# EAGLE design BesheRawanSafi (EAGLE 7.7.0)
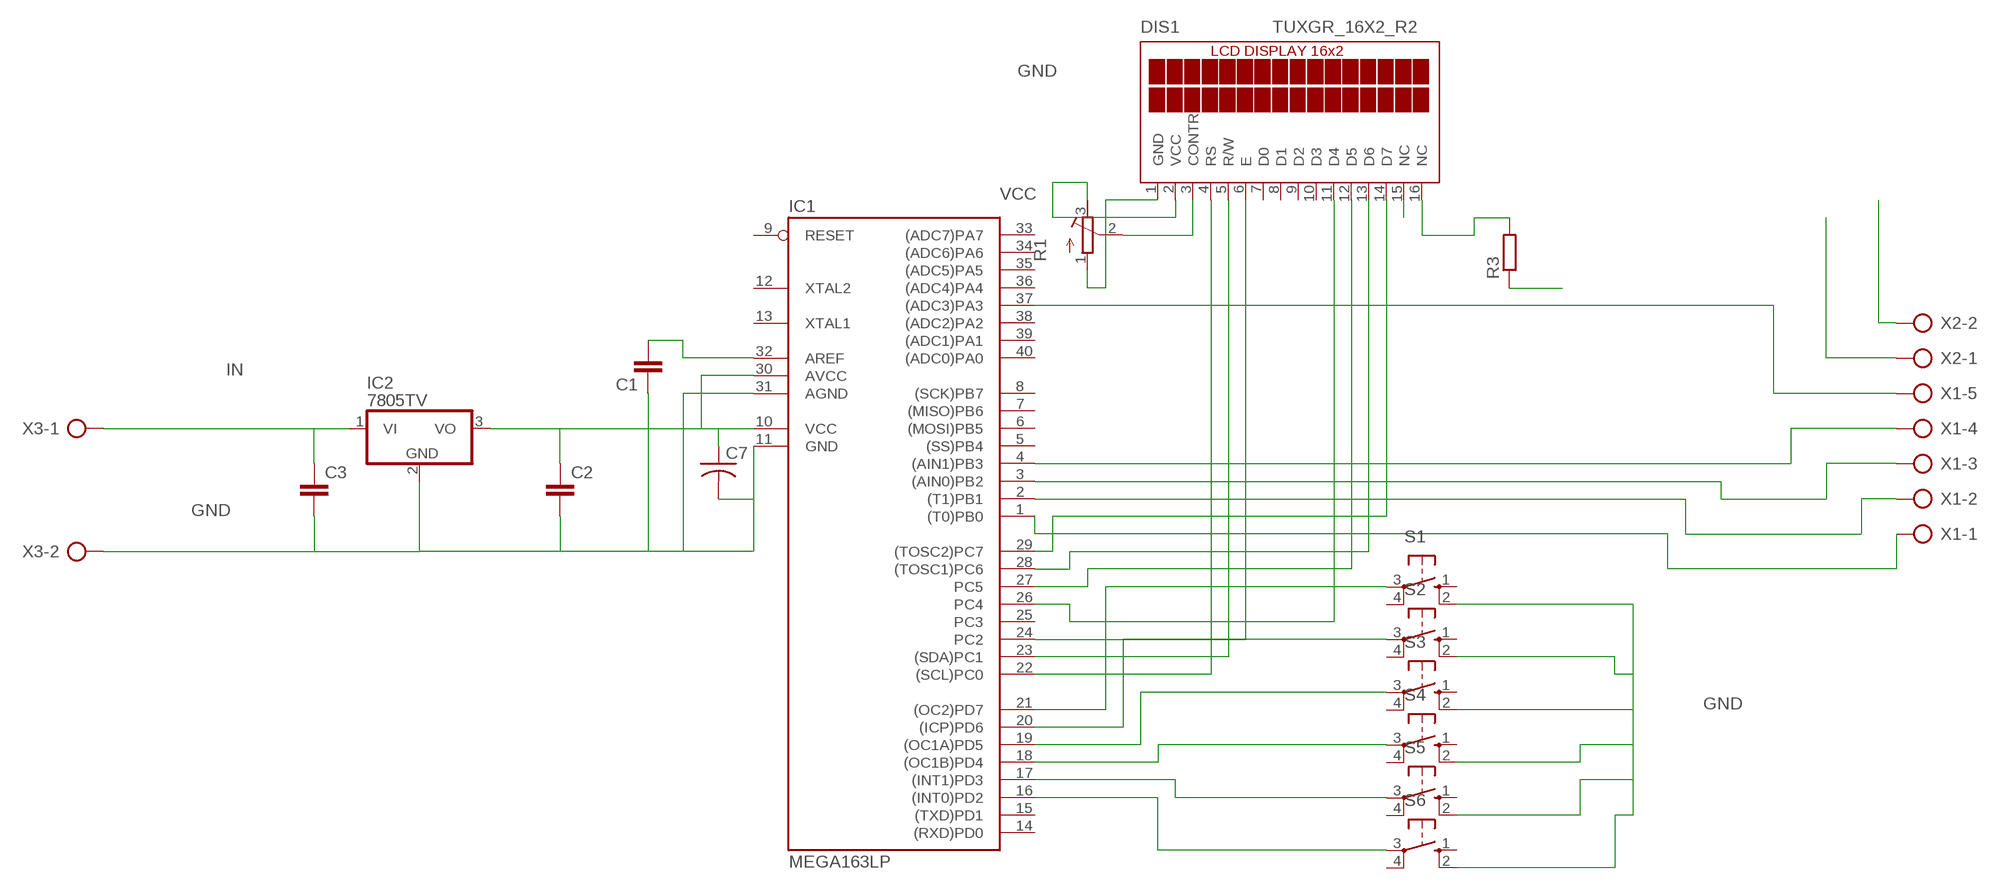
[diagram p0: schematic, sheet 1]

## Parts
C1  C5/3  [C5B3]
C2  C5/3  [C5B3]
C3  C5/3  [C5B3]
C7  C-US050-035X075  [C050-035X075]
DIS1  TUXGR_16X2_R2  [TUXGR_16X2_R2]
IC1  MEGA163LP  [DIL40]
IC2  7805TV  [TO220V]
R1  R-TRIMM64X  [RTRIM64X]
R3  R-EU_0207/7  [0207/7]
S1  10-XX  [B3F-10XX]
S2  10-XX  [B3F-10XX]
S3  10-XX  [B3F-10XX]
S4  10-XX  [B3F-10XX]
S5  10-XX  [B3F-10XX]
S6  10-XX  [B3F-10XX]
X1  AK500/5-H  [AK500/5-H]
X2  AK500/2-H  [AK500/2-H]
X3  AK300/2  [AK300/2]

## Nets
ASDASD: DIS1.16(NC) R3.2
GND: C1.1 C2.2 C3.2 C7.2 DIS1.1(GND) IC1.11(GND) IC1.31(AGND) IC2.2(GND) R1.1(E) R3.1 S1.2(S1) S2.2(S1) S3.2(S1) S4.2(S1) S5.2(S1) S6.2(S1) X2.1 X3.2
IN: C3.1 IC2.1(VI) X3.1
N$1: IC1.1((T0)PB0) X1.1
N$2: IC1.2((T1)PB1) X1.2
N$3: C1.2 IC1.32(AREF)
N$4: IC1.3((AIN0)PB2) X1.3
N$5: IC1.4((AIN1)PB3) X1.4
N$6: DIS1.13(D6) IC1.28((TOSC1)PC6)
N$7: DIS1.14(D7) IC1.29((TOSC2)PC7)
N$8: DIS1.12(D5) IC1.27(PC5)
N$9: DIS1.11(D4) IC1.26(PC4)
N$10: IC1.37((ADC3)PA3) X1.5
N$11: DIS1.4(RS) IC1.22((SCL)PC0)
N$12: DIS1.5(R/W) IC1.23((SDA)PC1)
N$13: DIS1.6(E) IC1.24(PC2)
N$15: DIS1.3(CONTR) R1.2(S)
N$25: IC1.21((OC2)PD7) S1.3(P)
N$26: IC1.20((ICP)PD6) S2.3(P)
N$27: IC1.19((OC1A)PD5) S3.3(P)
N$28: IC1.18((OC1B)PD4) S4.3(P)
N$29: IC1.17((INT1)PD3) S5.3(P)
N$30: IC1.16((INT0)PD2) S6.3(P)
VCC: C2.1 C7.1 DIS1.2(VCC) DIS1.15(NC) IC1.10(VCC) IC1.30(AVCC) IC2.3(VO) R1.3(A) X2.2
Unconnected: DIS1.7(D0) DIS1.8(D1) DIS1.9(D2) DIS1.10(D3) IC1.5((SS)PB4) IC1.6((MOSI)PB5) IC1.7((MISO)PB6) IC1.8((SCK)PB7) IC1.9(RESET) IC1.12(XTAL2) IC1.13(XTAL1) IC1.14((RXD)PD0) IC1.15((TXD)PD1) IC1.25(PC3) IC1.33((ADC7)PA7) IC1.34((ADC6)PA6) IC1.35((ADC5)PA5) IC1.36((ADC4)PA4) IC1.38((ADC2)PA2) IC1.39((ADC1)PA1) IC1.40((ADC0)PA0) S1.1(S) S1.4(P1) S2.1(S) S2.4(P1) S3.1(S) S3.4(P1) S4.1(S) S4.4(P1) S5.1(S) S5.4(P1) S6.1(S) S6.4(P1)

## Library data of the parts
C1-C3 = capacitor-wima:C: CAPACITOR naming: grid - package width
C7 = resistor:C-US: CAPACITOR, American symbol
DIS1 = display-lcd:TUXGR_16X2_R2: Tuxgraphics LCD display 16x2 characters reflective, without background light Source: tuxgr_12x2_r2.pdf; OC_FARNELL: unknown; OC_NEWARK: unknown
IC1 = atmel:MEGA163*P: MICROCONTROLLER 16 Kbytes FLASH 1 Kbytes EEPROM 1 Kbytes SRAM UART 8-channel 10 bit ADC hardware multiplier Source: avr.lbr; OC_FARNELL: unknown; OC_NEWARK: unknown
IC2 = linear:78*: Positive VOLTAGE REGULATOR Source: http://cache.national.com/ds/LM/LM78L05.pdf http://www.fairchildsemi.com/ds/LM/LM7805.pdf
R1 = resistor:R-TRIMM: Trimm resistor
R3 = rcl:R-EU_: RESISTOR, European symbol
S1-S6 = switch-omron:10-XX: OMRON SWITCH; MPN: B3F-1000; OC_FARNELL: 176432; OC_NEWARK: 36M3542
X1 = con-ptr500:AK500/5-H: CONNECTOR Aug. 2004 / PTR Meßtechnik: Die Bezeichnung der Serie AK505 wurde geändert. Es handelt sich hierbei um AK500 in horizontaler Ausführung.; OC_FARNELL: unknown; OC_NEWARK: unknown
X2 = con-ptr500:AK500/2-H: CONNECTOR Aug. 2004 / PTR Meßtechnik: Die Bezeichnung der Serie AK505 wurde geändert. Es handelt sich hierbei um AK500 in horizontaler Ausführung.; OC_FARNELL: unknown; OC_NEWARK: unknown
X3 = con-ptr500:AK300/2: CONNECTOR; OC_FARNELL: unknown; OC_NEWARK: unknown

## Board
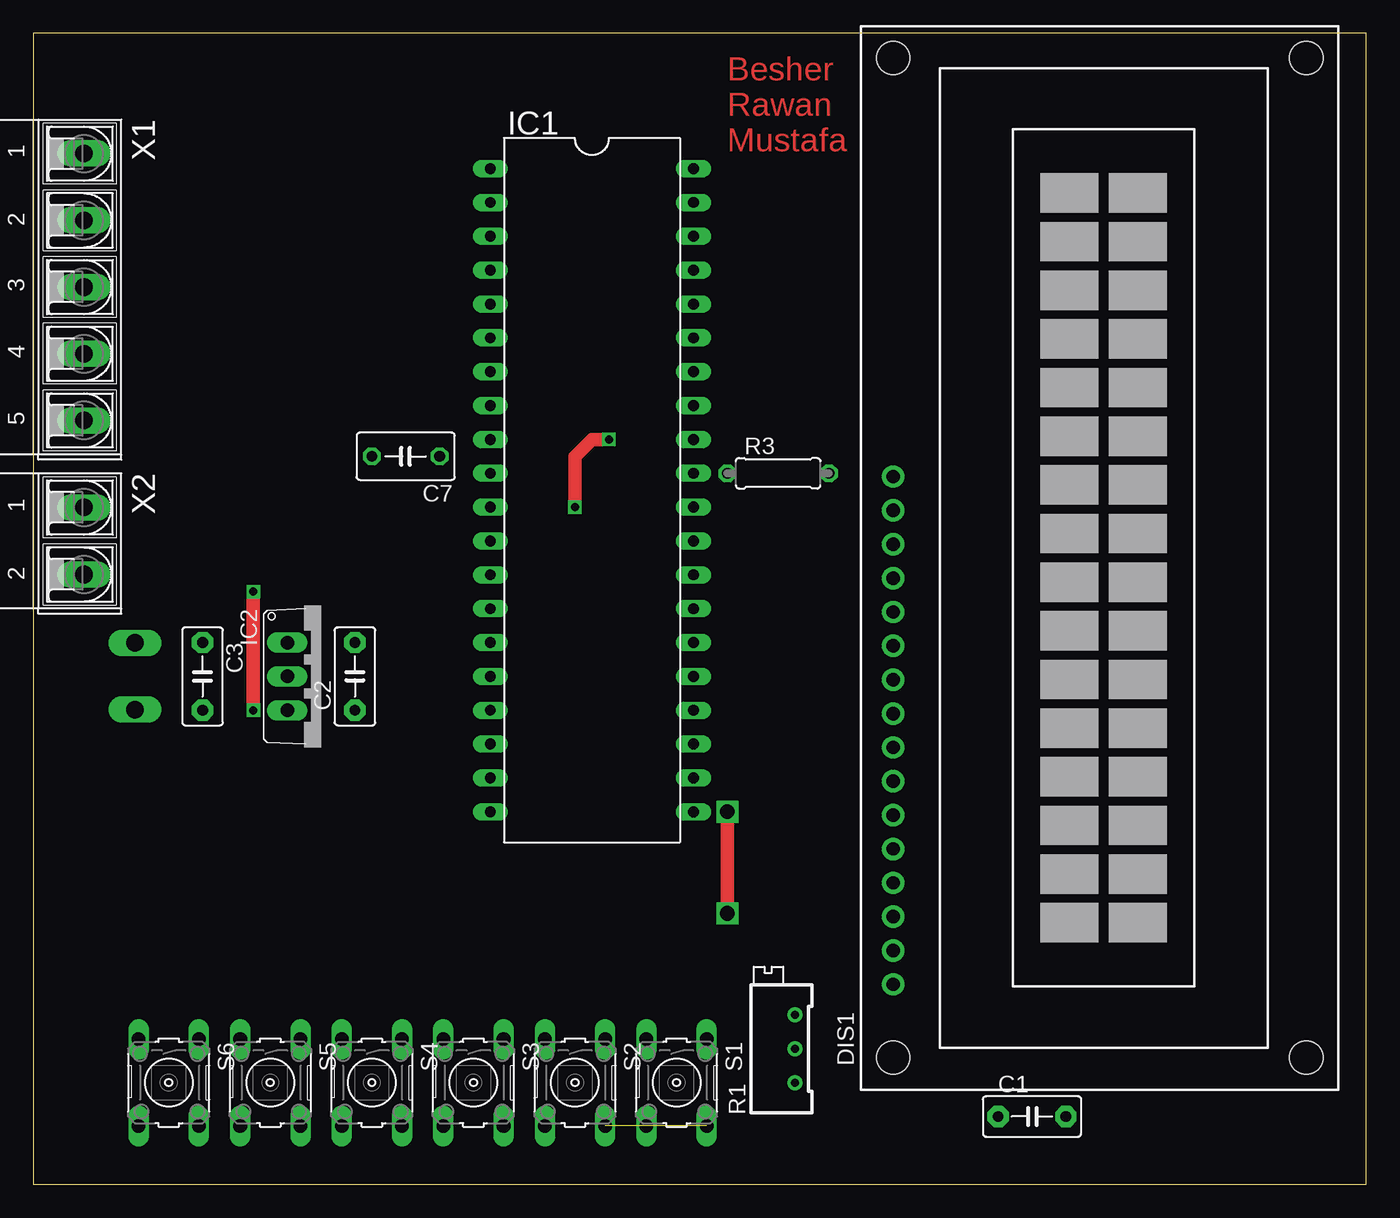
[diagram p1: board, top side]
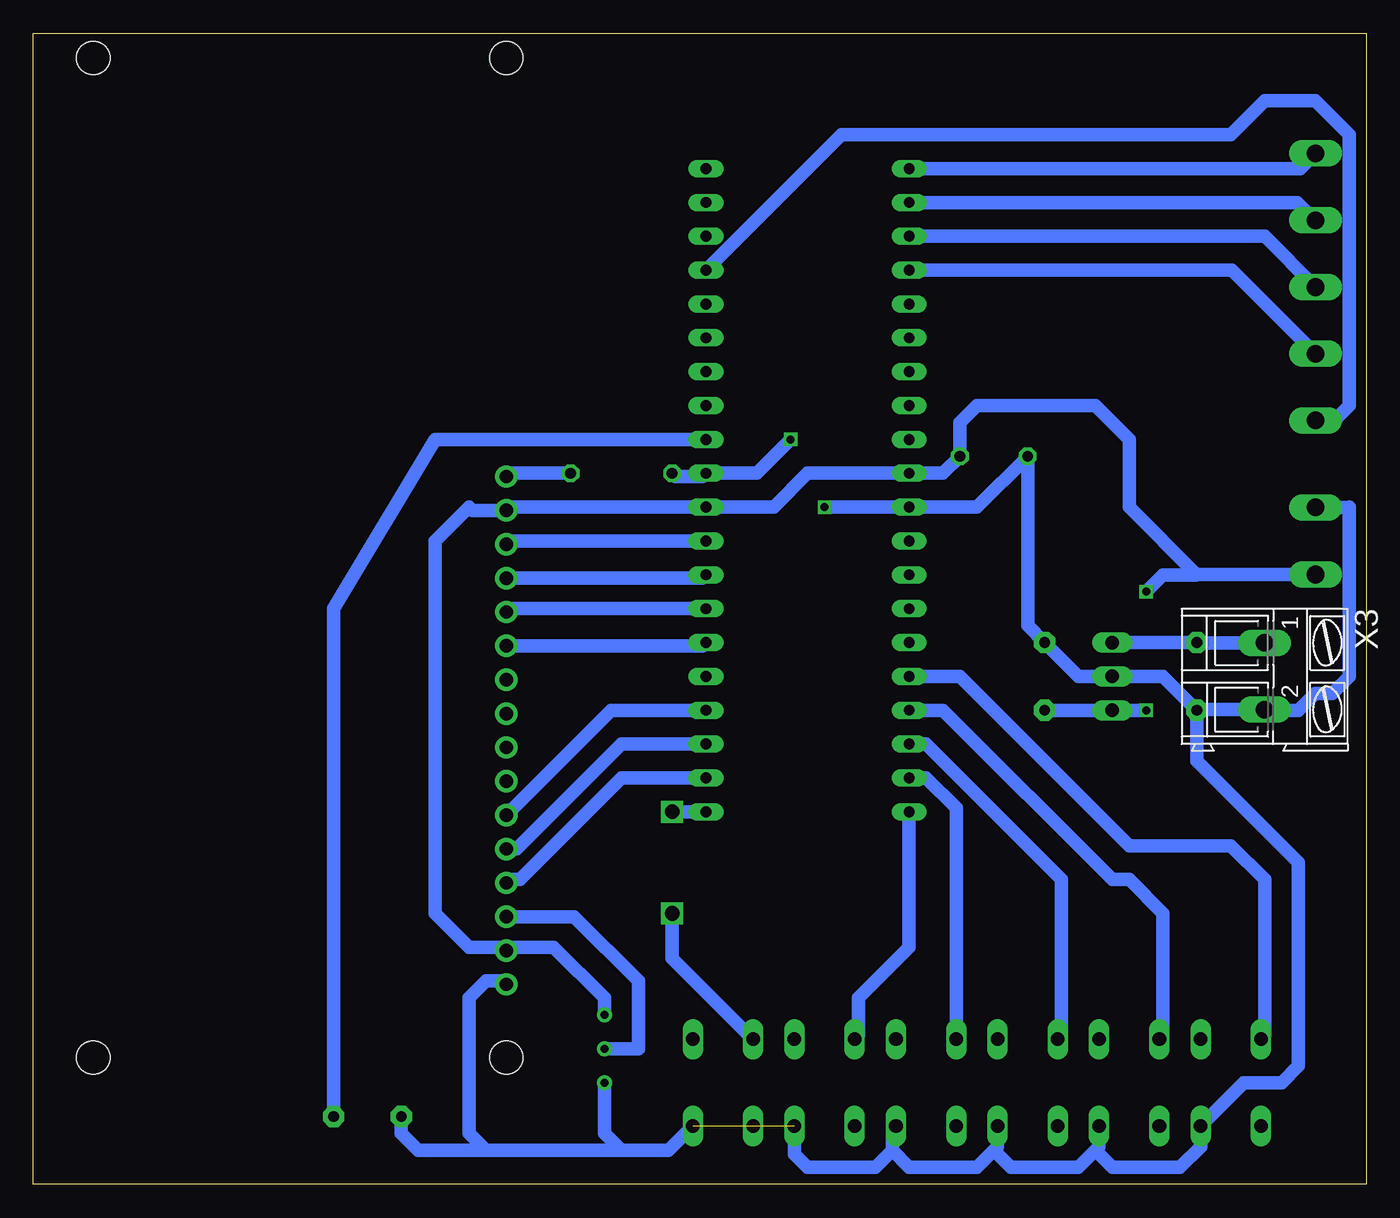
[diagram p2: board, bottom side, seen from below]

Size 100 x 86.35 mm. Coordinates in mm from the lower left corner, seen from the top.
Outline: 0,0 100,0 100,86.35 0,86.35 0,0
Copper layers (1*16): Top 0.035mm / dielectric 1.5mm / Bottom 0.035mm
Design rules "default": minimum track width 10mil, minimum drill 24mil, track to track 8mil, track to pad 8mil, pad to pad 8mil, via to via 8mil, smd to smd 8mil, copper to edge 40mil, drill to drill 8mil, minimum pad ring 10mil, minimum via ring 8mil, stop-mask expansion 4mil, vias tented up to drill 0mil, thermal gap 10mil

### Footprints (pad centres in the part's own frame; a part is rotated, then mirrored left to right if it is on the bottom)
C5B3 = drill 0.813 pad 1.6 octagon: 1 -2.54,0; 2 2.54,0
C050-035X075 = drill 0.813 octagon: 1 -2.54,0; 2 2.54,0
TUXGR_16X2_R2 = drill 1 pad 1.676: 1 -32,15.5; 2 -29.46,15.5; 3 -26.92,15.5; 4 -24.38,15.5; 5 -21.84,15.5; 6 -19.3,15.5; 7 -16.76,15.5; 8 -14.22,15.5; 9 -11.68,15.5; 10 -9.14,15.5; 11 -6.6,15.5; 12 -4.06,15.5; 13 -1.52,15.5; 14 1.02,15.5; 15 3.56,15.5; 16 6.1,15.5 | hole 2.5: -37.5,-15.5; 37.5,-15.5; -37.5,15.5; 37.5,15.5
DIL40 = drill 0.813 long: 1 -24.13,-7.62; 2 -21.59,-7.62; 3 -19.05,-7.62; 4 -16.51,-7.62; 5 -13.97,-7.62; 6 -11.43,-7.62; 7 -8.89,-7.62; 8 -6.35,-7.62; 9 -3.81,-7.62; 10 -1.27,-7.62; 11 1.27,-7.62; 12 3.81,-7.62; 13 6.35,-7.62; 14 8.89,-7.62; 15 11.43,-7.62; 16 13.97,-7.62; 17 16.51,-7.62; 18 19.05,-7.62; 19 21.59,-7.62; 20 24.13,-7.62; 21 24.13,7.62; 22 21.59,7.62; 23 19.05,7.62; 24 16.51,7.62; 25 13.97,7.62; 26 11.43,7.62; 27 8.89,7.62; 28 6.35,7.62; 29 3.81,7.62; 30 1.27,7.62; 31 -1.27,7.62; 32 -3.81,7.62; 33 -6.35,7.62; 34 -8.89,7.62; 35 -11.43,7.62; 36 -13.97,7.62; 37 -16.51,7.62; 38 -19.05,7.62; 39 -21.59,7.62; 40 -24.13,7.62
TO220V = drill 1.016 long: 1 -2.54,-2.54; 2 0,-2.54; 3 2.54,-2.54
RTRIM64X = drill 0.61: 1 1.27,-2.54; 2 1.27,0; 3 1.27,2.54
0207/7 = drill 0.813 octagon: 1 -3.81,0; 2 3.81,0
B3F-10XX = drill 1.016 long: 1 -3.251,2.261; 2 3.251,2.261; 3 -3.251,-2.261; 4 3.251,-2.261
AK500/5-H = drill 1.321 long: 1 -10.033,0; 2 -5.004,0; 3 0,0; 4 5.004,0; 5 10.008,0
AK500/2-H = drill 1.321 long: 1 -2.515,0; 2 2.515,0
AK300/2 = drill 1.321 long: 1 -2.515,0; 2 2.489,0

### Placement (x,y rotation side)
C1  74.93,5.08 0 top
C2  24.13,38.1 90 top
C3  12.7,38.1 270 top
C7  27.94,54.61 180 top
DIS1  80.01,46.99 90 top
IC1  41.91,52.07 270 top
IC2  21.59,38.1 270 top
R1  55.88,10.16 0 top
R3  55.88,53.34 0 top
S1  48.26,7.62 270 top
S2  40.64,7.62 270 top
S3  33.02,7.62 270 top
S4  25.4,7.62 270 top
S5  17.78,7.62 270 top
S6  10.16,7.62 270 top
X1  3.81,67.31 270 top
X2  3.81,48.26 270 top
X3  7.62,38.1 270 bottom

### Tracks (layer width: path | path; a pad name or v marks a point on that pad's centre or on a via)
ASDASD
  Bottom 1.016: R3.2 64.26,53.34 DIS1.16
GND  (via drill 0.6)  (1 unrouted)
  Top 1.016: v43.18,55.88 41.91,55.88 40.64,54.61 v40.64,50.8
  Bottom 1.016: 13.97,36.83 C3.2 | C3.2 15.24,38.1 IC2.2 21.59,38.1 C2.2 25.4,41.91 C7.2 29.21,50.8 IC1.11 v40.64,50.8 | C3.2 12.65,35.61 X3.2 7.57,35.56 5.08,35.56 3.81,36.83 2.54,36.83 1.27,38.1 1.27,50.8 1.29,50.77 X2.1 | S2.2 42.9,2.26 41.91,1.27 36.83,1.27 35.56,2.54 | 35.56,2.54 35.56,4.09 S3.2 | S4.2 27.66,2.82 27.94,2.54 | 27.94,2.54 29.21,1.27 34.29,1.27 35.56,2.54 | S5.2 20.04,2.82 20.32,2.54 | 20.32,2.54 21.59,1.27 26.67,1.27 27.94,2.54 | 20.32,2.54 19.05,1.27 13.97,1.27 12.42,2.82 S6.2 9.17,7.62 6.35,7.62 5.08,8.89 5.08,24.13 12.7,31.75 C3.2 | DIS1.1 64.76,15.24 66.04,15.24 67.31,13.97 67.31,3.81 66.04,2.54 | 66.04,2.54 55.88,2.54 | 55.88,2.54 52.35,2.54 S1.2 | C1.1 72.39,3.81 71.12,2.54 66.04,2.54 | R1.1 57.15,3.81 55.88,2.54 | R3.1 51.82,53.09 49.78,53.09 IC1.31 45.72,53.34 v43.18,55.88
IN
  Bottom 1.016: IC2.1 C3.1 12.68,40.62 X3.1
N$1
  Bottom 1.016: IC1.1 4.95,76.2 X1.1
N$2
  Bottom 1.016: IC1.2 5.16,73.66 X1.2
N$3
  Bottom 1.016: IC1.32 69.85,55.88 77.47,43.18 C1.2
N$4
  Bottom 1.016: IC1.3 7.62,71.12 X1.3
N$5
  Bottom 1.016: IC1.4 10.08,68.58 X1.4
N$6
  Bottom 1.016: DIS1.13 49.78,45.47 IC1.28
N$7
  Bottom 1.016: IC1.29 64.26,48.26 DIS1.14
N$8
  Bottom 1.016: IC1.27 64.26,43.18 DIS1.12
N$9
  Bottom 1.016: DIS1.11 49.78,40.39 IC1.26
N$10
  Bottom 1.016: X1.5 3.66,57.15 2.54,57.15 1.27,58.42 1.27,78.74 3.81,81.28 7.62,81.28 10.16,78.74 39.37,78.74 IC1.37
N$11
  Bottom 1.016: IC1.22 55.88,30.48 63.5,22.86 64.26,22.86 DIS1.4
N$12
  Bottom 1.016: DIS1.5 63.75,25.15 55.88,33.02 IC1.23
N$13
  Bottom 1.016: IC1.24 56.64,35.56 DIS1.6
N$15
  Bottom 1.016: DIS1.3 59.44,20.07 54.61,15.24 54.61,10.16 R1.2
N$25  (via drill 1.1)
  Top 1.016: v52.07,20.32 v52.07,27.94
  Bottom 1.016: v52.07,27.94 IC1.21 | v52.07,20.32 52.07,16.94 S1.3
N$26
  Bottom 1.016: IC1.20 34.29,17.78 38.1,13.97 38.1,11.15 S2.3
N$27
  Bottom 1.016: S3.3 30.76,28.22 33.02,30.48 IC1.19
N$28
  Bottom 1.016: IC1.18 33.02,33.02 22.86,22.86 22.86,11.15 S4.3
N$29
  Bottom 1.016: IC1.17 31.75,35.56 19.05,22.86 17.78,22.86 15.24,20.32 15.24,11.15 S5.3
N$30
  Bottom 1.016: IC1.16 30.48,38.1 17.78,25.4 10.16,25.4 7.62,22.86 7.62,11.15 S6.3
VCC  (via drill 0.6)
  Top 1.016: v16.51,35.56 v16.51,44.45
  Bottom 1.016: R1.3 57.15,13.97 60.96,17.78 64.26,17.78 | 64.26,17.78 DIS1.2 | X2.2 12.72,45.74 | 12.72,45.74 17.78,50.8 17.78,55.88 20.32,58.42 29.21,58.42 30.48,57.15 C7.1 31.75,53.34 IC1.10 41.91,53.34 44.45,50.8 IC1.30 64.26,50.8 DIS1.15 67.06,50.55 67.31,50.8 69.85,48.26 69.85,20.32 67.31,17.78 64.26,17.78 | C2.1 IC2.3 v16.51,35.56 | v16.51,44.45 15.24,45.72 12.75,45.72 12.72,45.74

### Text on the board
Top: Besher / Rawan / Mustafa